# Altium project MB102_Upgrade.PrjPcb
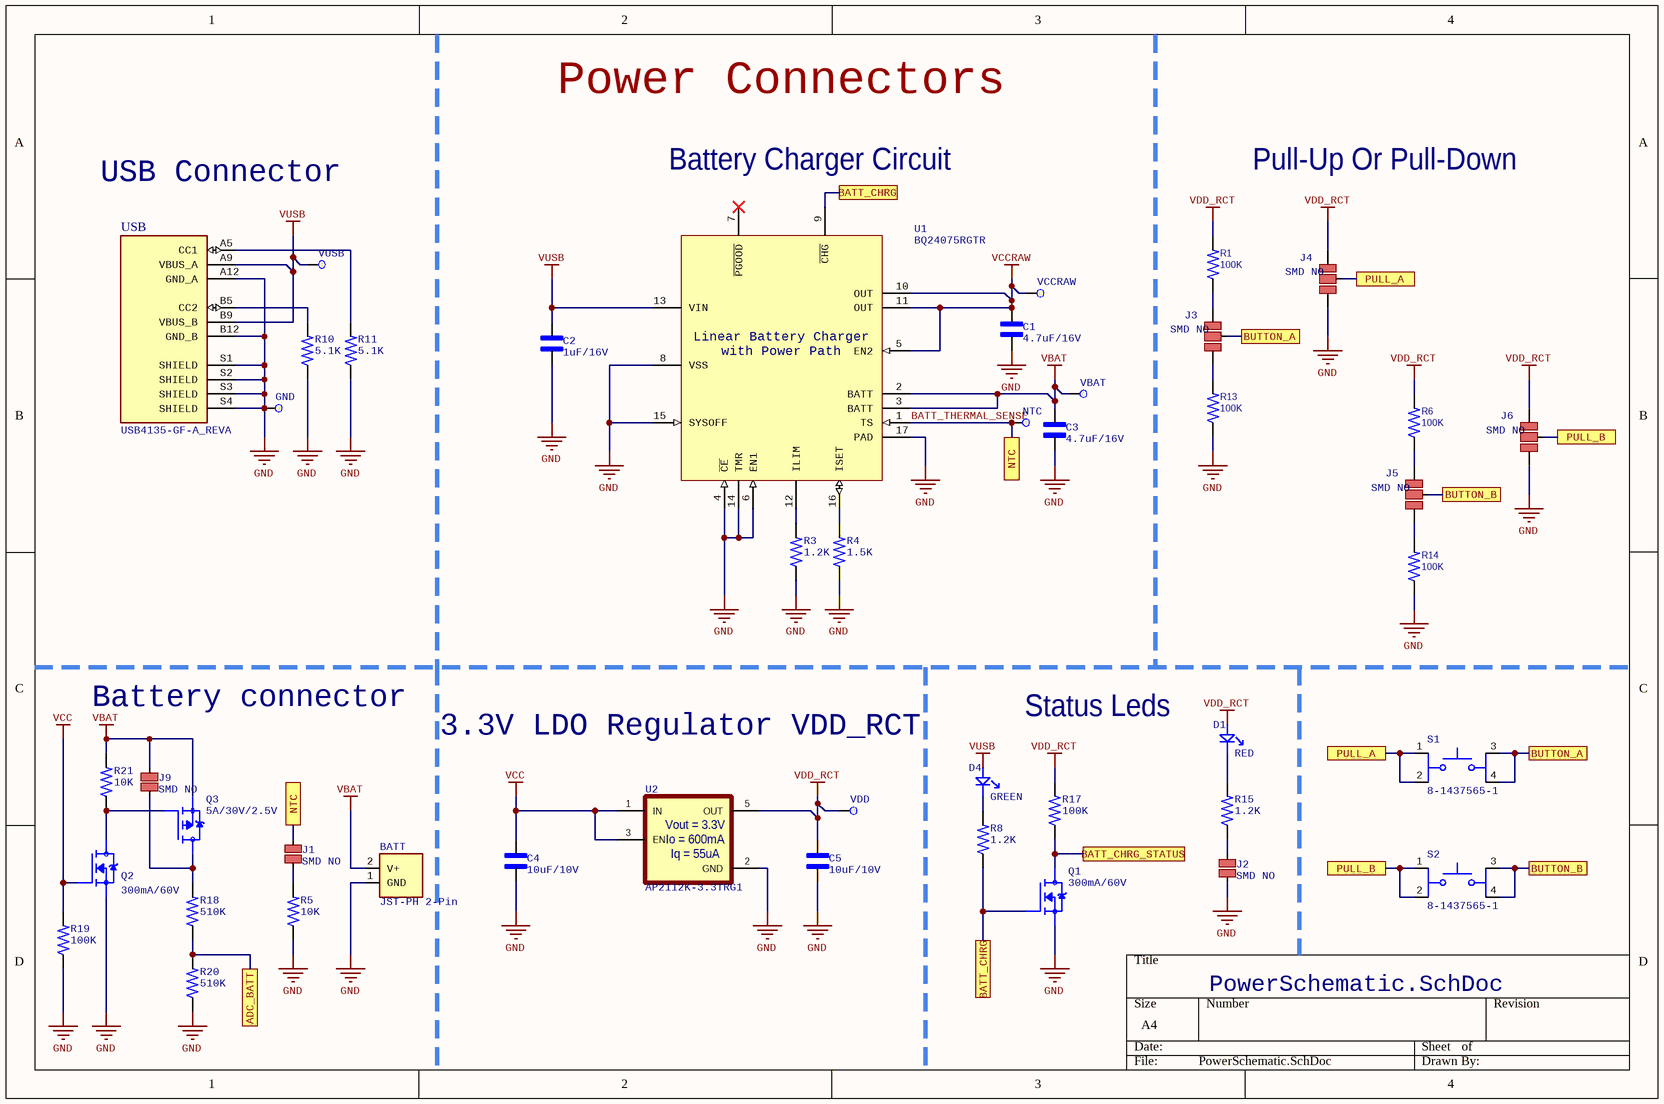
[diagram p0: PowerSchematic.SchDoc]
3 sheets, 81 parts. Net scope: flat (ports and power ports of the same name join across sheets).
Board file: MB102_Upgrade.PcbDoc
Sheets:
  PowerSchematic.SchDoc
  SwitchingRegulators.SchDoc
  Peripherals.SchDoc

## Sheet PowerSchematic.SchDoc
size A4; SheetNumber: 1; SheetTotal: 3

### Parts
BATT  JST-PH 2-Pin  [JST_B2B-PH-K-S(LF)(SN)]
C1  4.7uF/16V  [C0603]
C2  1uF/16V  [C0603]
C3  4.7uF/16V  [C0603]
C4  10uF/10V  [C0603]
C5  10uF/10V  [C0603]
D1  RED  [LED 0603]
D4  GREEN  [LED 0603]
GND  Test point 1.2mm  [TEST_POINT_1.2MM]  (value not drawn)  (no BOM)
J1  SMD NO  [JUMPER_SMD_NO]  (net tie, no BOM)
J2  SMD NO  [JUMPER_SMD_NO]  (net tie, no BOM)
J3  SMD NO  [JUMPER_SMD_NO_2WAY]  (net tie, no BOM)
J4  SMD NO  [JUMPER_SMD_NO_2WAY]  (net tie, no BOM)
J5  SMD NO  [JUMPER_SMD_NO_2WAY]  (net tie, no BOM)
J6  SMD NO  [JUMPER_SMD_NO_2WAY]  (net tie, no BOM)
J9  SMD NO  [JUMPER_SMD_NO]  (net tie, no BOM)
NTC  Test point 1.2mm  [TEST_POINT_1.2MM]  (value not drawn)  (no BOM)
Q1  300mA/60V  [SOT-23-3]
Q2  300mA/60V  [SOT-23-3]
Q3  5A/30V/2.5V  [SOT-23-3]
R1  100K  [R0603]
R3  1.2K  [R0603]
R4  1.5K  [R0603]
R5  10K  [R0603]
R6  100K  [R0603]
R8  1.2K  [R0603]
R10  5.1K  [R0603]
R11  5.1K  [R0603]
R13  100K  [R0603]
R14  100K  [R0603]
R15  1.2K  [R0603]
R17  100K  [R0603]
R18  510K  [R0603]
R19  100K  [R0603]
R20  510K  [R0603]
R21  10K  [R0603]
S1  8-1437565-1  [SW_8-1437565-1]
S2  8-1437565-1  [SW_8-1437565-1]
U1  BQ24075RGTR  [VQFN16]
U2  AP2112K-3.3TRG1  [SOT-25-5]
USB  USB4135-GF-A_REVA  [GCT_USB4135 16-pin]
VBAT  Test point 1.2mm  [TEST_POINT_1.2MM]  (value not drawn)  (no BOM)
VCCRAW  Test point 1.2mm  [TEST_POINT_1.2MM]  (value not drawn)  (no BOM)
VDD  Test point 1.2mm  [TEST_POINT_1.2MM]  (value not drawn)  (no BOM)
VUSB  Test point 1.2mm  [TEST_POINT_1.2MM]  (value not drawn)  (no BOM)

### Ports
ADC_BATT (see Peripherals[4C]), BATT_CHRG (see PowerSchematic[3A]), BATT_CHRG (see PowerSchematic[3D]), BATT_CHRG_STATUS (see Peripherals[4C]), BUTTON_A (see Peripherals[1C], PowerSchematic[3B]), BUTTON_A (see Peripherals[1C], PowerSchematic[4C]), BUTTON_B (see Peripherals[1C], PowerSchematic[4B]), BUTTON_B (see Peripherals[1C], PowerSchematic[4D]), NTC (see PowerSchematic[1D]), NTC (see PowerSchematic[3B]), PULL_A (see PowerSchematic[4B]), PULL_A (see PowerSchematic[4C]), PULL_B (see PowerSchematic[4B]), PULL_B (see PowerSchematic[4D])

### Nets
GND: BATT.1(GND) C1.2 C2.2 C3.2 C4.2 C5.2 GND.1 J2.2 J4.1 J6.1 Q1.2(S) Q2.2(S) R3.1 R4.1 R5.1 R10.1 R11.1 R13.1 R14.1 R19.1 R20.1 U1.4(~{CE}) U1.6(EN1) U1.8(VSS) U1.14(TMR) U1.15(SYSOFF) U1.17(PAD) U2.2(GND) USB.A12(GND_A) USB.B12(GND_B) USB.S1(SHIELD) USB.S2(SHIELD) USB.S3(SHIELD) USB.S4(SHIELD)
VBAT: BATT.2(V+) C3.1 J9.1 Q3.2(S) R21.2 U1.2(BATT) U1.3(BATT) VBAT.1
VCC: C4.1 Q2.1(G) R19.2 U2.1(IN) U2.3(EN)
VCCRAW: C1.1 U1.5(EN2) U1.10(OUT) U1.11(OUT) VCCRAW.1
VDD_RCT: C5.1 D1.1(A) J4.3 J6.3 R1.2 R6.2 R17.2 U2.5(OUT) VDD.1
VUSB: C2.1 D4.1(A) U1.13(VIN) USB.A9(VBUS_A) USB.B9(VBUS_B) VUSB.1
BATT_THERMAL_SENSE: J1.1 NTC.1 U1.1(TS) ; port NTC
NetBUTTONS_1: J3.2 S1.3 S1.4 ; port BUTTON_A
NetBUTTONS_2: J5.2 S2.3 S2.4 ; port BUTTON_B
NetD1_2: D1.2(K) R15.2
NetD4_2: D4.2(K) R8.2
NetJ1_2: J1.2 R5.2
NetJ2_1: J2.1 R15.1
NetJ3_1: J3.1 R13.2
NetJ3_3: J3.3 R1.1
NetJ4_2: J4.2 S1.1 S1.2 ; port PULL_A
NetJ5_1: J5.1 R14.2
NetJ5_3: J5.3 R6.1
NetJ6_2: J6.2 S2.1 S2.2 ; port PULL_B
NetJ9_2: J9.2 Q3.3(D) R18.2
NetP6_1: Q1.3(D) R17.1 ; port BATT_CHRG_STATUS
NetP6_2: R18.1 R20.2 ; port ADC_BATT
NetQ1_1: Q1.1(G) R8.1 U1.9(~{CHG}) ; port BATT_CHRG
NetQ2_3: Q2.3(D) Q3.1(G) R21.1
NetR3_2: R3.2 U1.12(ILIM)
NetR4_2: R4.2 U1.16(ISET)
NetR10_2: R10.2 USB.B5(CC2)
NetR11_2: R11.2 USB.A5(CC1)

Not connected (* = marked no-connect by the designer): U1 7(~{PGOOD})*

### Notes on the sheet
- Power Connectors
- USB Connector
- Battery Charger Circuit
- Pull-Up Or Pull-Down
- Battery connector
- 3.3V LDO Regulator VDD_RCT
- Status Leds
- (in symbol AP2112K-3.3TRG1) Vout = 3.3V; Io = 600mA; Iq = 55uA
- (in symbol BQ24075RGTR) Linear Battery Charger; with Power Path

### Library data of the parts
BATT = JST-PH 2-Pin: JST (JAPAN SOLDERLESS TERMINALS) - B2B-PH-K-S(LF)(SN) - Pin Header, Top Entry, Wire-to-Board, 2 mm, 1 Rows, 2 Contacts, Through Hole, PH Series; Supplier 1: LCSC; Supplier Part Number 1: C131337; Manufacturer: JST; Manufacturer Part Number: B2B-PH-K-S(LF)(SN); RoHS: Yes; Category: Connectors; Stock 1: 3352380; Pricing 1: 20=0.03960, 200=0.03310, 600=0.02840, 2000=0.02160, 10000=0.02100, 20000=0.02070 (USD); Weight: 0.0625lb; Length: 0.2inch; Width: 0.24inch; Height: 0.35inch
C1 C3 = C0603 4.7uF/16V: 0603 4.7 uF 16 V ±10% Tolerance X5R Multilayer Ceramic Capacitor; Manufacturer: Murata; Manufacturer Part Number: GRT188R61C475KE13D; Value: 4.7uF; Voltage Rating: 16V; Supplier 1: Mouser; Supplier Part Number 1: 81-GRT188R61C475KE3D; RoHS: Yes; Category: Ceramic Capacitors; Stock 1: 39950; Pricing 1: 1=0.16, 10=0.066, 50=0.066, 100=0.038, 1000=0.034, 10000=0.029 (USD); Mounting Technology: Surface Mount; Case/Package: 0603; Case Code (Metric): 1608; Case Code (Imperial): 0603; Min Operating Temperature: -55°C; Max Operating Temperature: 85°C; Packaging: Cut Tape; Tolerance: 10%; Series: GRT; Length: 0.063inch; Width: 0.031inch; Thickness: 0.035inch; Ratings: AEC-Q200; RoHS Compliant: Yes
C2 = C0603 1uF/16V X5R: MLCC 1uF 16V X5R 10% SMD 0603 85C Paper T/R; Manufacturer: Yageo; Manufacturer Part Number: CC0603KRX5R7BB105; Dissipation Factor: 7%; Supplier 1: Mouser; Supplier Part Number 1: 603-CC603KRX5R7BB105; RoHS: Yes; Category: Ceramic Capacitors; Stock 1: 726921; Pricing 1: 1=0.17000, 10=0.09100, 50=0.09100, 100=0.04100, 1000=0.03400, 10000=0.02100 (USD); Mount: Surface Mount; Case/Package: 0603; Number of Pins: 2; Case Code (Imperial): 0603; Case Code (Metric): 1608; Min Operating Temperature: -55°C; Max Operating Temperature: 85°C; Capacitance: 1uF; Tolerance: 10%; Dielectric: X5R; Voltage Rating: 16V; Voltage Rating (DC): 16V; Packaging: Tape and Reel; Package Quantity: 4000; Termination: SMD/SMT; Resistor Type: Ceramic; Series: CC; Construction: Flat; Length: 1.6mm; Width: 0.8mm; Height: 0.8mm; Thickness: 0.035inch; Depth: 0.8mm; Radiation Hardening: No; REACH SVHC: Unknown; Lead Free: Lead Free; Halogen Free: Halogen Free; RoHS Compliant: Yes
C4 C5 = C0603 10uF/10V: MLCC 10uF 10V X5R 20% 0603; Manufacturer: Samsung; Manufacturer Part Number: CL10A106MP8NNND; Supplier 1: Mouser; Supplier Part Number 1: 187-CL10A106MP8NNND; RoHS: Yes; Category: Ceramic Capacitors; Stock 1: 58774; Pricing 1: 1=0.20000, 10=0.14000, 50=0.14000, 100=0.06600, 1000=0.03900, 10000=0.03000 (USD); Supplier 2: Mouser; Supplier Part Number 2: 963-LMK107BBJ106MAHT; RoHS Compliant: Yes
D1 = LED 0603 RED: Red 625nm LED Indication - Discrete 2V 0603; Manufacturer: Wurth Electronics; Manufacturer Part Number: 150060RS55040; Luminous Intensity: 90mcd; Lens Style: Flat; Viewing Angle: 140°; Dominant Wavelength: 624nm; Test Current: 20mA; Lens Transparency: Diffused; Lens Size: 0.8mm; Supplier 1: Mouser; Supplier Part Number 1: 710-150060RS55040; RoHS: No; Category: LEDs; Stock 1: 8586; Pricing 1: 1=0.18000, 10=0.16200, 100=0.14700, 500=0.13200, 1000=0.11700, 2000=0.11700 (USD); Mount: Surface Mount; Case/Package: 0603; Color: Red; Forward Voltage: 2V; Packaging: Tape and Reel; Height: 0.5mm; Case Code (Imperial): 0603; Case Code (Metric): 1608; Length: 1.6mm; Width: 0.8mm
D4 = LED 0603 GREEN: Green 575nm LED Indication - Discrete 2V 0603; Manufacturer: Wurth Electronics; Manufacturer Part Number: 150060VS55040; Luminous Intensity: 60mcd; Lens Style: Flat; Viewing Angle: 140°; Dominant Wavelength: 573nm; Test Current: 20mA; Lens Transparency: Diffused; Lens Size: 0.8mm; Supplier 1: Mouser; Supplier Part Number 1: 710-150060VS55040; RoHS: No; Category: LEDs; Stock 1: 24940; Pricing 1: 1=0,18000, 10=0,16200, 50=0,16200, 100=0,14700, 1000=0,11700, 10000=0,11700 (USD); Mount: Surface Mount; Case/Package: 0603; Color: Green; Forward Voltage: 2V; Packaging: Cut Tape; Height: 0.5mm; Case Code (Imperial): 0603; Case Code (Metric): 1608; Length: 1.6mm; Width: 0.8mm
GND NTC VBAT VCCRAW VDD VUSB = Test point: SMD test point
J1 J2 J9 = JUMPER_SMD_NO: Rule: UNIONINDEX=0|RULEKIND=ShortCircuit|NETSCOPE=AnyNet|LAYERKIND=SameLayer|NAME=Schematic Short-Circuit Constraint|ALLOWED=TRUE|UNIT=Imperial
J3-J6 = JUMPER_SMD_NO_2WAY
Q1 Q2 = MOSFET N-CH 2N7002,215: Trans MOSFET N-CH 60V 0.3A 3-Pin TO-236AB T/R; Manufacturer: Nexperia; Supplier 1: Mouser; Supplier Part Number 1: 771-2N7002-T/R; Manufacturer Part Number: 2N7002,215; RoHS: No; Category: MOSFETs; Stock 1: 82531; Pricing 1: 1=0.16000, 10=0.13800, 100=0.05900, 500=0.04800, 1000=0.03300, 3000=0.02500, 9000=0.02200, 24000=0.02000, 45000=0.01500 (USD)
Q3 = MOSFET P-CH 30V/5A SI2347DS-T1-GE3: P-Channel 30 V 42 mOhm 22 nC Surface Mount Power Mosfet - SOT-23-3; Manufacturer: Vishay Semiconductors; Rise Time: 6ns; Rds On Max: 42mR; Input Capacitance: 705pF; Drain to Source Voltage (Vdss): 30V; Continuous Drain Current (ID): 3.8A; Max Power Dissipation: 1.7W; Fall Time: 9ns; Gate to Source Voltage (Vgs): 20V; Drain to Source Resistance: 68mR; Turn-Off Delay Time: 19ns; Number of Elements: 1; Threshold Voltage: -2.5V; Element Configuration: Single; Drain to Source Breakdown Voltage: -30V; Supplier 1: Mouser; Supplier Part Number 1: 78-SI2347DS-T1-GE3; Manufacturer Part Number: Si2347DS-T1-GE3; RoHS: Yes; Category: MOSFETs; Stock 1: 90370; Pricing 1: 1=0.41000, 10=0.27600, 50=0.27600, 100=0.14500, 1000=0.10000, 10000=0.07700 (USD); Mount: Surface Mount; Case/Package: SOT-23-3; Number of Pins: 3; Contact Plating: Tin,Matte; Min Operating Temperature: -55°C; Max Operating Temperature: 150°C; Packaging: Tape and Reel; Package Quantity: 3000; Power Dissipation: 1.7W; Polarity: P-CHANNEL; Series: TrenchFET®; Radiation Hardening: No; REACH SVHC: No SVHC; Lead Free: Lead Free; RoHS Compliant: Yes
R1 R6 R13 R14 = R0603 100K: RES 0603 100K OHM 1% 1/10W; Manufacturer: Yageo; Manufacturer Part Number: RC0603FR-07100KL; Resistance: 100kR; Power Rating: 100mW; Voltage Rating: 50V; Temperature Coefficient: 100ppm/°C; Working Voltage: 75V; RoHS: Yes; Category: Chip SMD Resistors; Stock 1: 4536807; Pricing 1: 1=0.10000, 10=0.02100, 100=0.00900, 1000=0.00400, 5000=0.00300, 10000=0.00200 (USD); Case/Package: 0603; Number of Pins: 2; Case Code (Imperial): 0603; Case Code (Metric): 1608; Min Operating Temperature: -55°C; Max Operating Temperature: 155°C; Tolerance: 1%; Packaging: Tape and Reel; Resistor Type: Thick Film; Termination: SMD/SMT; Voltage Rating (DC): 50V; Length: 1.6mm; Depth: 0.8mm; REACH SVHC: No SVHC; Military Standard: Not; Lead Free: Lead Free; Supplier 1: Mouser; Supplier Part Number 1: 603-RC0603FR-07100KL; Number of Terminations: 2; Height: 0.45mm; Width: 0.8mm
R3 R8 R15 = R0603 1.2K: RES 0603 1.2K OHM 1% 1/10W; Manufacturer: Yageo; Manufacturer Part Number: RC0603FR-071K2L; Power Rating: 100mW; Voltage Rating: 50V; Resistance: 1.2kR; Temperature Coefficient: 100ppm/°C; Supplier 1: Mouser; Supplier Part Number 1: 603-RC0603FR-071K2L; RoHS: Yes; Category: Chip SMD Resistors; Stock 1: 27884; Pricing 1: 1=0.10000, 10=0.02400, 50=0.02400, 100=0.01000, 1000=0.00400, 10000=0.00300 (USD); Case/Package: 0603; Number of Pins: 2; Case Code (Imperial): 0603; Case Code (Metric): 1608; Size Code: 0603; Min Operating Temperature: -55°C; Max Operating Temperature: 155°C; Tolerance: 1%; Voltage Rating (DC): 50V; Packaging: Tape and Reel; Termination: SMD/SMT; Resistor Type: Thick Film; Features: Moisture Resistant; Series: RC; Max Power Dissipation: 100mW; Number of Terminations: 2; Construction: Rectangular; Resistance Tolerance: 1%; Length: 1.6mm; Width: 0.8mm; Height: 0.45mm; Depth: 0.8mm; REACH SVHC: No SVHC; Military Standard: Not; Lead Free: Lead Free; RoHS Compliant: Yes; ComponentLink1URL: http://www.farnell.com/datasheets/443971.pdf?src-supplier=Farnell; ComponentLink1Description: http://www.farnell.com/datasheets/443971.pdf?src-supplier=Farnell; ComponentLink2URL: http://www.farnell.com/datasheets/1868787.pdf?src-supplier=Farnell; ComponentLink2Description: http://www.farnell.com/datasheets/1868787.pdf?src-supplier=Farnell; ComponentLink3URL: http://www.farnell.com/datasheets/2167052.pdf?src-supplier=Farnell; ComponentLink3Description: http://www.farnell.com/datasheets/2167052.pdf?src-supplier=Farnell; ComponentLink4URL: http://www.mouser.com/ds/2/447/RC0603-272842.pdf?src-supplier=Mouser; ComponentLink4Description: http://www.mouser.com/ds/2/447/RC0603-272842.pdf?src-supplier=Mouser; ComponentLink5URL: http://components.arrow.com/part/dataview/0323_00047720?src-supplier=Arrow+Europe; ComponentLink5Description: http://components.arrow.com/part/dataview/0323_00047720?src-supplier=Arrow+Europe; ComponentLink6URL: http://www.farnell.com/datasheets/443971.pdf?src-supplier=Element14; ComponentLink6Description: http://www.farnell.com/datasheets/443971.pdf?src-supplier=Element14; ComponentLink7URL: http://www.farnell.com/datasheets/2167052.pdf?src-supplier=Newark; ComponentLink7Description: http://www.farnell.com/datasheets/2167052.pdf?src-supplier=Newark; ComponentLink8URL: http://www.farnell.com/datasheets/1868787.pdf?src-supplier=Element14; ComponentLink8Description: http://www.farnell.com/datasheets/1868787.pdf?src-supplier=Element14; ComponentLink9URL: http://www.farnell.com/datasheets/2167052.pdf?src-supplier=Element14; ComponentLink9Description: http://www.farnell.com/datasheets/2167052.pdf?src-supplier=Element14; ComponentLink10URL: http://www.yageo.com/documents/recent/PYu-RC0603_51_RoHS_L_7.pdf?src-supplier=Future+Electronics; ComponentLink10Description: http://www.yageo.com/documents/recent/PYu-RC0603_51_RoHS_L_7.pdf?src-supplier=Future+Electronics; ComponentLink11URL: https://www.verical.com/server-webapp/html/getDatasheet?partID=326670&src-supplier=Verical; ComponentLink11Description: https://www.verical.com/server-webapp/html/getDatasheet?partID=326670&src-supplier=Verical; ComponentLink12URL: http://www.farnell.com/datasheets/1868787.pdf?src-supplier=Newark; ComponentLink12Description: http://www.farnell.com/datasheets/1868787.pdf?src-supplier=Newark; ComponentLink13URL: http://www.yageo.com/documents/recent/PYu-RC_Group_51_RoHS_L_9.pdf?src-supplier=Digi-Key; ComponentLink13Description: http://www.yageo.com/documents/recent/PYu-RC_Group_51_RoHS_L_9.pdf?src-supplier=Digi-Key; ComponentLink14URL: http://www.yageo.com/documents/recent/PYu-RC_Group_51_RoHS_L_10.pdf?src-supplier=Digi-Key; ComponentLink14Description: http://www.yageo.com/documents/recent/PYu-RC_Group_51_RoHS_L_10.pdf?src-supplier=Digi-Key
R4 = R0603 1.5K: RES 0603 1.5K OHM 0.5% 1/10W; Manufacturer: Yageo; Manufacturer Part Number: RC0603FR-071K5L; Tolerance: 1%; Resistance: 1.5kR; Temperature Coefficient: 100ppm/°C; Voltage Rating (DC): 50V; Power Rating: 100mW; Supplier 1: Mouser; Supplier Part Number 1: 603-RC0603FR-071K5L; RoHS: Yes; Category: Chip SMD Resistors; Stock 1: 312486; Pricing 1: 1=0.10000, 10=0.01800, 50=0.01800, 100=0.00600, 1000=0.00500, 10000=0.00300 (USD); Case/Package: 0603; Number of Pins: 2; Case Code (Metric): 1608; Case Code (Imperial): 0603; Min Operating Temperature: -55°C; Max Operating Temperature: 155°C; Packaging: Tape and Reel; Resistor Type: Thick Film; Voltage Rating: 50V; Package Quantity: 1; Number of Terminations: 2; Termination: SMD/SMT; Max Power Dissipation: 100mW; Features: Moisture Resistant; Length: 0.063inch; Width: 0.031inch; Height: 0.022inch; Depth: 0.8mm; REACH SVHC: No SVHC; Lead Free: Lead Free; Military Standard: Not
R5 R21 = R0603 10K: SMD Chip Resistor, 10 kOhm, ± 1%, 100 mW, 0603 [1608 Metric], Thick Film, Anti-Sulfur; Manufacturer: Yageo; Manufacturer Part Number: AF0603FR-0710KL; Power Rating: 100mW; Temperature Coefficient: 100ppm/°C; Voltage Rating: 50V; Value: 10kR; Supplier 1: Mouser; Supplier Part Number 1: 603-AF0603FR-0710KL; RoHS: Yes; Category: Chip SMD Resistors; Case/Package: 0603; Case Code (Imperial): 0603; Case Code (Metric): 1608; Min Operating Temperature: -55°C; Max Operating Temperature: 155°C; Tolerance: 1%; Packaging: Tape and Reel; Package Quantity: 1; Termination: SMD/SMT; Number of Terminations: 2; Max Power Dissipation: 100mW; Features: Moisture Resistant,Anti-Sulfur; Length: 0.063inch; Width: 0.031inch; Height: 0.022inch; Lead Free: 5697LeadFree; Supplier 2: Mouser; Supplier Part Number 2: 667-ERJ-3EKF1002V; Stock 3: 5000; Pricing 3: 5000=0.00223, 10000=0.00219, 20000=0.00213 (USD); Series: AF; RoHS Compliant: Yes
R10 R11 = R0603 5.1K: RES 0603 5.1K OHM 1% 1/10W; Manufacturer: Yageo; Manufacturer Part Number: RC0603FR-075K1L; Power Rating: 100mW; Temperature Coefficient: 100ppm/°C; Resistance: 5.1kR; Voltage Rating: 50V; Supplier 1: Mouser; Supplier Part Number 1: 603-RC0603FR-075K1L; RoHS: Yes; Category: Chip SMD Resistors; Stock 1: 557916; Case/Package: 0603; Number of Pins: 2; Case Code (Imperial): 0603; Case Code (Metric): 1608; Min Operating Temperature: -55°C; Max Operating Temperature: 155°C; Tolerance: 1%; Packaging: Tape and Reel; Package Quantity: 1; Termination: SMD/SMT; Resistor Type: Thick Film; Number of Terminations: 2; Max Power Dissipation: 100mW; Voltage Rating (DC): 50V; Features: Moisture Resistant; Length: 0.063inch; Width: 0.031inch; Height: 0.022inch; Depth: 0.8mm; REACH SVHC: No SVHC; Military Standard: Not; Lead Free: Lead Free
R17 R19 = R0603 100K: RES 0603 100K OHM 1% 1/10W; Manufacturer: Yageo; Manufacturer Part Number: RC0603FR-07100KL; Power Rating: 100mW; Voltage Rating: 50V; Resistance: 100kR; Temperature Coefficient: 100ppm/°C; Working Voltage: 75V; Supplier 1: Mouser; Supplier Part Number 1: 603-RC0603FR-07100KL; RoHS: Yes; Category: Chip SMD Resistors; Stock 1: 4536807; Pricing 1: 1=0.10000, 10=0.02100, 100=0.00900, 1000=0.00400, 5000=0.00300, 10000=0.00200 (USD); Case/Package: 0603; Number of Pins: 2; Case Code (Imperial): 0603; Case Code (Metric): 1608; Min Operating Temperature: -55°C; Max Operating Temperature: 155°C; Tolerance: 1%; Voltage Rating (DC): 50V; Packaging: Tape and Reel; Termination: SMD/SMT; Resistor Type: Thick Film; Number of Terminations: 2; Length: 1.6mm; Width: 0.8mm; Height: 0.45mm; Depth: 0.8mm; REACH SVHC: No SVHC; Military Standard: Not; Lead Free: Lead Free
R18 R20 = R0603 510K: RES 0603 510K OHM 1% 1/10W; Manufacturer: TE Connectivity; Manufacturer Part Number: CPF0603B510KE; Tolerance: 0.1%; Temperature Coefficient: 25ppm/°C; Max Power Dissipation: 63mW; Resistance: 510kR; Supplier 1: Mouser; Supplier Part Number 1: 279-CPF0603B510KE; RoHS: Yes; Category: Uncategorized; Case/Package: 0603; Case Code (Imperial): 0603; Case Code (Metric): 1608; Min Operating Temperature: -55°C; Max Operating Temperature: 155°C; Packaging: Cut Tape; Number of Terminations: 2; Series: CPF, Neohm; RoHS Compliant: Yes; Stock 1: 16357; Pricing 1: 1=0.49, 10=0.329, 50=0.329, 100=0.187, 1000=0.1, 10000=0.092 (USD)
S1 S2 = 8-1437565-1: Switch Tactile OFF (ON) SPST Round Button Gull Wing 0.05A 24VDC 1.57N SMD T/R; Manufacturer: TE Connectivity Alcoswitch; Actuator Material: Brass; Mechanical Life: 500000Cycles; Illumination Type: Non-Illuminated; Contact Current Rating: 20mA; Switch Function: Off-Mom; Switch Travel: 0.25mm; Actuator Type: Standard; Max Voltage Rating (DC): 15V; Contact Resistance: 100mR; Number of Positions: 2NUMBER; Actuator Length: 0.4mm; Supplier 1: Mouser; Supplier Part Number 1: 506-8-1437565-1; Manufacturer Part Number: 8-1437565-1; RoHS: Yes; Category: Pushbutton Switches; Stock 1: 20150; Pricing 1: 1=0.72, 10=0.72, 50=0.72, 100=0.697, 1000=0.567, 10000=0.371 (USD); Mount: Surface Mount; Case/Package: SMD/SMT; Contact Material: Copper Alloy; Contact Plating: Silver; Min Operating Temperature: -35°C; Max Operating Temperature: 85°C; Packaging: Tape and Reel; Throw Configuration: SPST; Operating Force: 1.57N; Termination: Gull Wing; Series: FSMCT; Package Quantity: 4000; Type: Switch; Orientation: Straight; Electrical Life: 500000Cycles; Height: 1.7mm; Radiation Hardening: No; RoHS Compliant: Yes; Lead Free: 5697LeadFree; ELV: 5681ELVCompliant; ComponentLink1URL: https://datasheet.ciiva.com/8082/eng-cs-1308111-1-switches-core-program-catalog-0308-8082416.pdf?src-supplier=Avnet; ComponentLink1Description: https://datasheet.ciiva.com/8082/eng-cs-1308111-1-switches-core-program-catalog-0308-8082416.pdf?src-supplier=Avnet
U1 = BQ24075RGTR: IC LI-ION CHARGE MGMT 16-QFN; Manufacturer: Texas Instruments; Output Voltage: 4.2V; Output Current: 1.5A; Min Supply Voltage: 4.35V; Max Supply Voltage: 6.4V; Min Input Voltage: 4.3V; Number of Cells: 1; Interface: USB; Fault Protection: Over Voltage,Over Temperature,Short Circuit,Reverse Current; Battery Chemistry: LITHIUM-ION; Supplier 1: Mouser; Supplier Part Number 1: 595-BQ24075RGTR; Manufacturer Part Number: BQ24075RGTR; RoHS: Yes; Category: Battery Management; Stock 1: 21933; Pricing 1: 1=2.52000, 10=2.27000, 50=2.14000, 100=1.82000, 1000=1.24000, 10000=1.24000 (USD); Case/Package: VQFN; Number of Pins: 16; Weight: 0.000808oz; Contact Plating: Gold; Min Operating Temperature: -40°C; Max Operating Temperature: 125°C; Packaging: Tape and Reel; Package Quantity: 3000; Series: -; Max Charge Current: 1.5A; Battery Pack Voltage: 4.2V; Radiation Hardening: No; Lead Free: Lead Free; RoHS Compliant: Yes; ComponentLink1URL: https://datasheet.ciiva.com/15114/getdatasheetpartid-471953-15114762.pdf?src-supplier=Verical; ComponentLink1Description: https://datasheet.ciiva.com/15114/getdatasheetpartid-471953-15114762.pdf?src-supplier=Verical; ComponentLink2URL: https://datasheet.ciiva.com/3214/bq24079-3214043.pdf?src-supplier=Avnet; ComponentLink2Description: https://datasheet.ciiva.com/3214/bq24079-3214043.pdf?src-supplier=Avnet; ComponentLink3URL: https://datasheet.ciiva.com/1934/bq24072-1934514.pdf?src-supplier=Digi-Key; ComponentLink3Description: https://datasheet.ciiva.com/1934/bq24072-1934514.pdf?src-supplier=Digi-Key; Supplier 2: Digi-Key; Supplier Part Number 2: 296-38874-1-ND; Supplier 3: Digi-Key; Supplier Part Number 3: 296-38874-2-ND; Supplier 4: Arrow Electronics; Supplier Part Number 4: BQ24075RGTR
U2 = AP2112K-3.3TRG1: IC REG LINEAR 3.3V 600MA SOT25; Manufacturer: Diodes; Min Input Voltage: 2.5V; Number of Outputs: 1; Dropout Voltage: 250mV; Max Input Voltage: 6V; Quiescent Current: 55uA; Polarity: Positive; Accuracy: 1.5%; Output Type: Fixed; Supplier 1: Mouser; Supplier Part Number 1: 621-AP2112K-3.3TRG1; Manufacturer Part Number: AP2112K-3.3TRG1; RoHS: Yes; Category: Voltage Regulators - Linear; Stock 1: 4864; Pricing 1: 1=0.47000, 10=0.31700, 50=0.31700, 100=0.15000, 1000=0.11600, 10000=0.08900 (USD); Mount: Surface Mount; Case/Package: SOT-23-5; Number of Pins: 5; Min Operating Temperature: -40°C; Max Operating Temperature: 85°C; Package Quantity: 1; Packaging: Tape and Reel; Output Voltage: 3.3V; Output Current: 600mA; Number of Regulators: 1; Max Output Current: 600mA; Length: 3.1mm; Width: 1.7mm; Height: 1.3mm; Lead Free: Lead Free; RoHS Compliant: Yes; ComponentLink1URL: https://datasheet.ciiva.com/29569/ap2112-29569917.pdf?src-supplier=Digi-Key; ComponentLink1Description: https://datasheet.ciiva.com/29569/ap2112-29569917.pdf?src-supplier=Digi-Key; ComponentLink2URL: https://datasheet.ciiva.com/29569/ap2112-29569918.pdf?src-supplier=Digi-Key; ComponentLink2Description: https://datasheet.ciiva.com/29569/ap2112-29569918.pdf?src-supplier=Digi-Key; ComponentLink3URL: https://datasheet.ciiva.com/29569/ap2112-29569919.pdf?src-supplier=Digi-Key; ComponentLink3Description: https://datasheet.ciiva.com/29569/ap2112-29569919.pdf?src-supplier=Digi-Key; ComponentLink4URL: https://datasheet.ciiva.com/30016/ap2112-30016792.pdf?src-supplier=Avnet; ComponentLink4Description: https://datasheet.ciiva.com/30016/ap2112-30016792.pdf?src-supplier=Avnet
USB = USB4135-GF-A_REVA: Usb C Rec Gf Ra 6P SMT & SMT She; Manufacturer 1: Global Connector Technology; Supplier 1: Mouser; Supplier Part Number 1: 640-USB4135-GF-A; Manufacturer Part Number 1: USB4135-GF-A; RoHS: No; Category: Connectors; Stock 1: 1196; Pricing 1: 1=0.67300, 50=0.59700, 100=0.56000, 250=0.52200, 500=0.46600, 1000=0.43300, 1500=0.40000, 3000=0.33600 (USD)

## Sheet SwitchingRegulators.SchDoc
size Letter; SheetNumber: 2; SheetTotal: 3
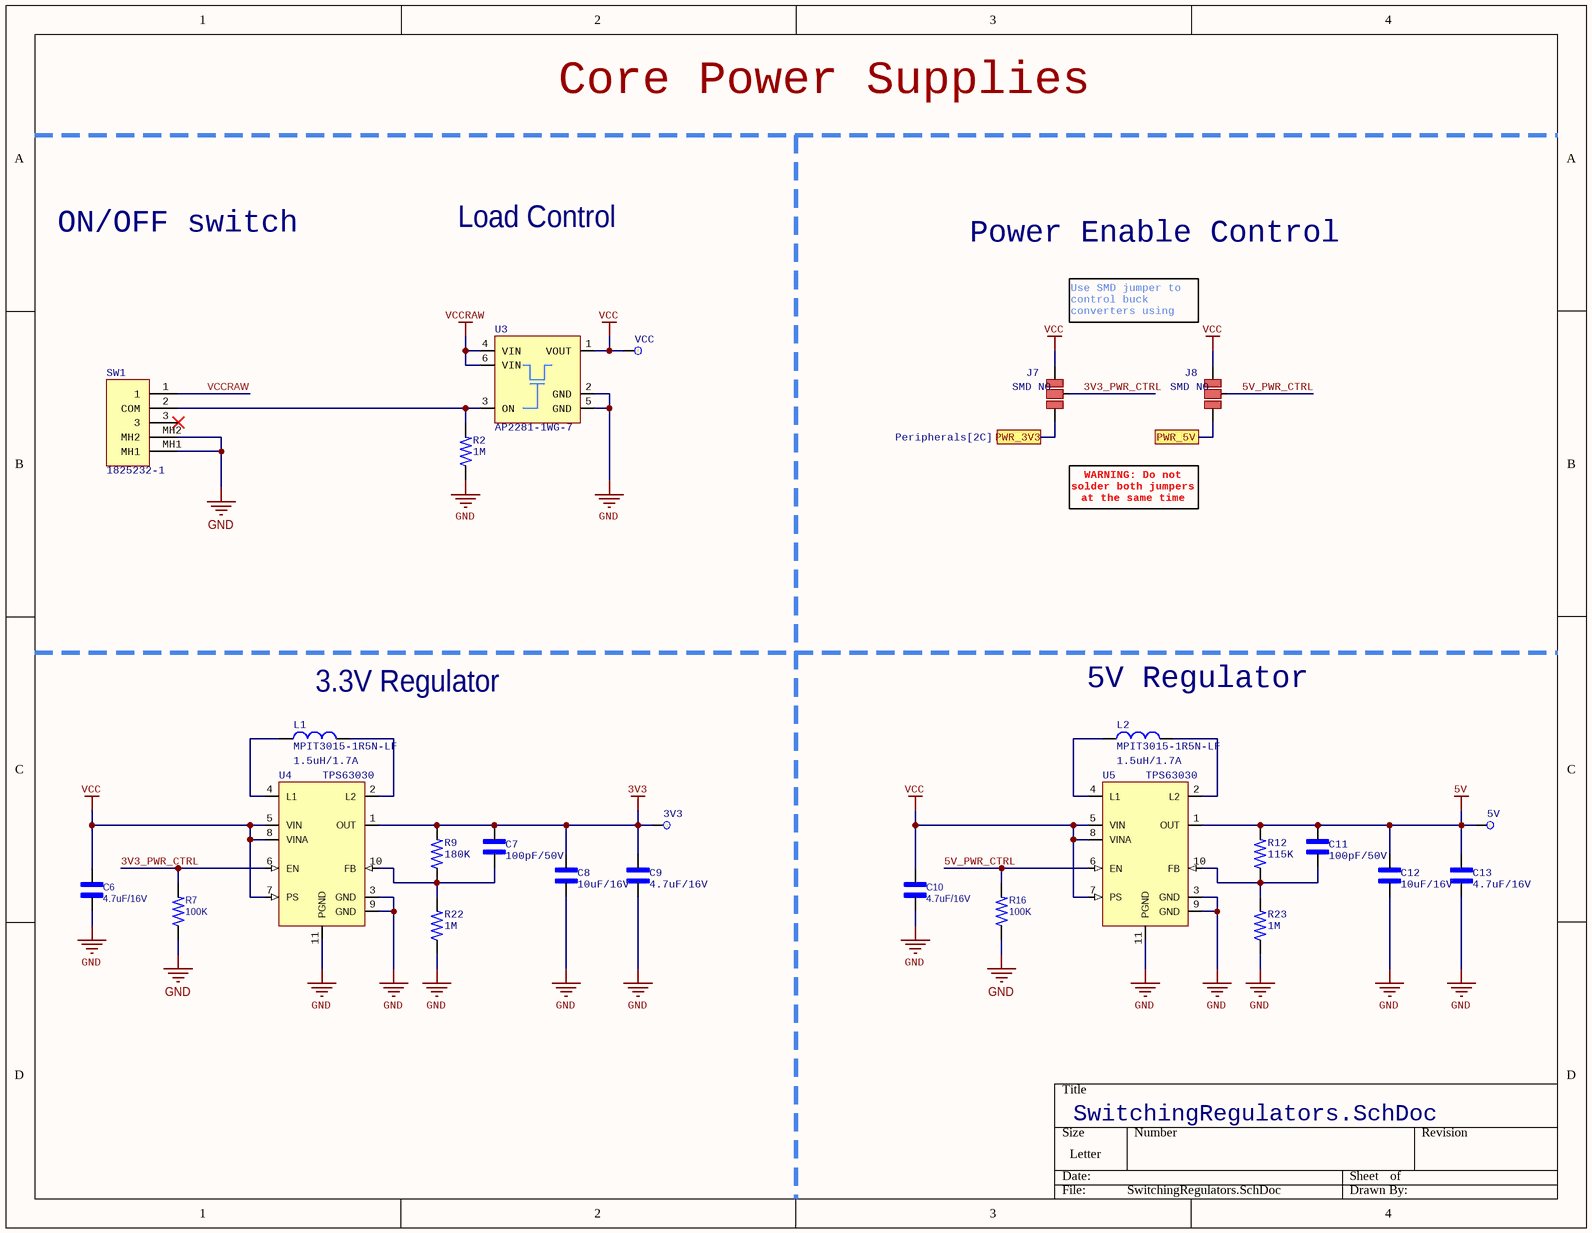
[diagram p1: SwitchingRegulators.SchDoc]

### Parts
3V3  Test point 1.2mm  [TEST_POINT_1.2MM]  (value not drawn)  (no BOM)
5V  Test point 1.2mm  [TEST_POINT_1.2MM]  (value not drawn)  (no BOM)
C6  4.7uF/16V  [C0603]
C7  100pF/50V  [C0603]
C8  10uF/16V  [C0603]
C9  4.7uF/16V  [C0603]
C10  4.7uF/16V  [C0603]
C11  100pF/50V  [C0603]
C12  10uF/16V  [C0603]
C13  4.7uF/16V  [C0603]
J7  SMD NO  [JUMPER_SMD_NO_2WAY]  (net tie, no BOM)
J8  SMD NO  [JUMPER_SMD_NO_2WAY]  (net tie, no BOM)
L1  1.5uH/1.7A  [L3030_SHIELD_H15]
L2  1.5uH/1.7A  [L3030_SHIELD_H15]
R2  1M  [R0603]
R7  100K  [R0603]
R9  180K  [R0603]
R12  115K  [R0603]
R16  100K  [R0603]
R22  1M  [R0603]
R23  1M  [R0603]
SW1  1825232-1  [1825232-1]
U3  AP2281-1WG-7  [SOT-26-6]
U4  TPS63030  [WSON-N10]
U5  TPS63030  [WSON-N10]
VCC  Test point 1.2mm  [TEST_POINT_1.2MM]  (value not drawn)  (no BOM)

### Ports
PWR_3V3 (see Peripherals[2C]), PWR_5V (see Peripherals[2C])

### Nets
3V3: 3V3.1 C7.1 C8.1 C9.1 R9.2 U4.1(OUT)
5V: 5V.1 C11.1 C12.1 C13.1 R12.2 U5.1(OUT)
GND: C6.2 C8.2 C9.2 C10.2 C12.2 C13.2 R2.1 R7.1 R16.1 R22.1 R23.1 SW1.MH1 SW1.MH2 U3.2(GND) U3.5(GND) U4.3(GND) U4.9(GND) U4.11(PGND) U5.3(GND) U5.9(GND) U5.11(PGND)
VCC: C6.1 C10.1 J7.3 J8.3 U3.1(VOUT) U4.5(VIN) U4.7(PS) U4.8(VINA) U5.5(VIN) U5.7(PS) U5.8(VINA) VCC.1
VCCRAW: SW1.1 U3.4(VIN) U3.6(VIN)
3V3_PWR_CTRL: J7.2 R7.2 U4.6(EN)
5V_PWR_CTRL: J8.2 R16.2 U5.6(EN)
NetC7_2: C7.2 R9.1 R22.2 U4.10(FB)
NetC11_2: C11.2 R12.1 R23.2 U5.10(FB)
NetJ7_1: J7.1 ; port PWR_3V3
NetJ8_1: J8.1 ; port PWR_5V
NetL1_1: L1.1 U4.4(L1)
NetL1_2: L1.2 U4.2(L2)
NetL2_1: L2.1 U5.4(L1)
NetL2_2: L2.2 U5.2(L2)
NetR2_2: R2.2 SW1.2(COM) U3.3(ON)

Not connected (* = marked no-connect by the designer): SW1 3*

### Notes on the sheet
- Core Power Supplies
- ON/OFF switch
- Load Control
- Power Enable Control
- Use SMD jumper to control buck converters using MCU
- WARNING: Do not solder both jumpers at the same time
- (near L1) 3.3V Regulator
- (near L2) 5V Regulator

### Library data of the parts
3V3 5V VCC = Test point: SMD test point
C6 C9 C10 C13 = C0603 4.7uF/16V: MLCC 0603 4.7uF 16V 10% X5R; Manufacturer 1: Murata; Manufacturer Part Number 1: GRT188R61C475KE13D; Supplier 1: Mouser; Supplier Part Number 1: 81-GRT188R61C475KE3D; RoHS: Yes; Category: Ceramic Capacitors; Stock 1: 39950; Pricing 1: 1=0.16, 10=0.066, 50=0.066, 100=0.038, 1000=0.034, 10000=0.029 (USD); RoHS Compliant: Yes; Mounting Technology: Surface Mount; Case/Package: 0603; Case Code (Metric): 1608; Case Code (Imperial): 0603; Min Operating Temperature: -55°C; Max Operating Temperature: 85°C; Packaging: Cut Tape; Value: 4.7uF; Voltage Rating: 16V; Tolerance: 10%; Series: GRT; Length: 0.063inch; Width: 0.031inch; Thickness: 0.035inch; Ratings: AEC-Q200
C7 C11 = C0603 100pF/50V: AVX - 06035A101JAT2A - SMD Multilayer Ceramic Capacitor, 100 pF, 5%, C0G / NP0, 50 V, 0603 [1608 Metric] RoHS Compliant: Yes; Manufacturer: Kyocera AVX; Capacitance: 100pF; Voltage Rating (DC): 50V; Temperature Coefficient: 30ppm/°C; Insulation Resistance: 100GR; Supplier 1: Mouser; Supplier Part Number 1: 581-06035A101J; Manufacturer Part Number: 06035A101JAT2A; RoHS: Yes; Category: Ceramic Capacitors; Stock 1: 438925; Pricing 1: 1=0.10000, 10=0.04100, 50=0.04100, 100=0.03300, 1000=0.01900, 10000=0.01200 (USD); Mount: Surface Mount,PCB; Case/Package: 0603; Number of Pins: 2; Case Code (Metric): 1608; Case Code (Imperial): 0603; Min Operating Temperature: -55°C; Max Operating Temperature: 125°C; Tolerance: 5%; Dielectric: C0G; Packaging: Tape and Reel; Voltage: 50V; Voltage Rating: 50V; Package Quantity: 1; Termination: SMD/SMT; Length: 1.6mm; Width: 0.032inch; Height: 0.9mm; Depth: 0.81mm; Thickness: 0.035inch; Radiation Hardening: No; REACH SVHC: No SVHC; Lead Free: Lead Free; RoHS Compliant: Yes; Supplier 2: Mouser; Supplier Part Number 2: 77-VJ0603A101JXAAC
C8 C12 = C0603 10uF/16V: MLCC 0603 10uF 16V 20% X5R; Manufacturer 1: Murata; Manufacturer Part Number 1: GRM188R61C106MAALD; Material: Ceramic; Supplier 1: Mouser; Supplier Part Number 1: 81-GRM188R61C106MALD; RoHS: Yes; Category: Ceramic Capacitors; Stock 1: 9439; Pricing 1: 1=0.38000, 10=0.27100, 50=0.27100, 100=0.16200, 1000=0.10300, 10000=0.08800 (USD); Mount: Surface Mount; Case/Package: 0603; Case Code (Metric): 1608; Case Code (Imperial): 0603; Min Operating Temperature: -55°C; Max Operating Temperature: 85°C; Packaging: Cut Tape; Capacitance: 10uF; Voltage Rating: 16V; Tolerance: 20%; Voltage Rating (DC): 16V; Length: 0.063inch; Width: 0.031inch; Height: 0.8mm; Thickness: 0.037inch; Lead Free: Lead Free; Supplier 2: Mouser; Supplier Part Number 2: 81-ZRB18AR61C106ME1L; Supplier 3: Mouser; Supplier Part Number 3: 810-C1608X5R1C106M
J7 J8 = JUMPER_SMD_NO_2WAY
L1 L2 = MPIT3015-1R5N-LF: Inductor Power Shielded Wirewound 1.5uH 20% 152MHz Metal 2.3A 0.05Ohm DCR 1212 T/R; Manufacturer 1: microgate; Supplier 1: LCSC; Supplier Part Number 1: C486478; RoHS: Yes; Category: Fixed Inductors; Manufacturer Part Number 1: MPIT3015-1R5N-LF
R2 = R0603 1M: RES SMD 1M OHM 1% 1/10W 0603; Manufacturer: Yageo; Manufacturer Part Number: RC0603FR-071ML; Voltage Rating: 75V; Voltage Rating (DC): 50V; Resistance: 1MR; Power Rating: 100mW; Temperature Coefficient: 100ppm/°C; Application(s): HIGH RELIABILITY; Supplier 1: Mouser; Supplier Part Number 1: 603-RC0603FR-071ML; RoHS: Yes; Category: Chip SMD Resistors; Stock 1: 1321822; Pricing 1: 1=0.10000, 10=0.01800, 50=0.01800, 100=0.00700, 1000=0.00400, 10000=0.00200 (USD); Case/Package: 0603; Number of Pins: 2; Case Code (Imperial): 0603; Case Code (Metric): 1608; Weight: 0.000847oz; Min Operating Temperature: -55°C; Max Operating Temperature: 155°C; Tolerance: 1%; Packaging: Cut Tape; Package Quantity: 5000; Termination: SMD/SMT; Resistor Type: Thick Film; Type: General Purpose; Series: RC; Technology: THICK FILM; Length: 1.6mm; Width: 0.8mm; Height: 0.45mm; Depth: 0.8mm; RoHS Compliant: Yes; REACH SVHC: No SVHC; Military Standard: Not; Lead Free: Lead Free
R7 R16 = R0603 100K: as R1 on sheet PowerSchematic; RoHS: Yes; Category: Chip SMD Resistors; Stock 1: 4536807; Pricing 1: 1=0.10000, 10=0.02100, 100=0.00900, 1000=0.00400, 5000=0.00300, 10000=0.00200 (USD); Case/Package: 0603; Number of Pins: 2; Case Code (Imperial): 0603; Case Code (Metric): 1608; Min Operating Temperature: -55°C; Max Operating Temperature: 155°C; Tolerance: 1%; Packaging: Tape and Reel; Resistor Type: Thick Film; Termination: SMD/SMT; Voltage Rating (DC): 50V; Length: 1.6mm; Depth: 0.8mm; REACH SVHC: No SVHC; Military Standard: Not; Lead Free: Lead Free; Supplier 1: Mouser; Supplier Part Number 1: 603-RC0603FR-07100KL; Number of Terminations: 2; Height: 0.45mm; Width: 0.8mm
R9 = R0603 220K: RES 0603 220K OHM 1% 1/10W; Manufacturer 1: Yageo; Manufacturer Part Number 1: RC0603FR-07220KL; Power Rating: 100mW; Voltage Rating: 50V; Temperature Coefficient: 100ppm/°C; Resistance: 220kR; Supplier 1: Mouser; Supplier Part Number 1: 603-RC0603FR-07220KL; RoHS: Yes; Category: Chip SMD Resistors; Stock 1: 155701; Pricing 1: 1=0.10000, 10=0.02400, 50=0.02400, 100=0.01000, 1000=0.00400, 10000=0.00300 (USD); Case/Package: 0603; Case Code (Metric): 1608; Case Code (Imperial): 0603; Min Operating Temperature: -55°C; Max Operating Temperature: 155°C; Packaging: Tape and Reel; Tolerance: 1%; Number of Terminations: 2; Termination: SMD/SMT; Max Power Dissipation: 100mW; Series: RC; Length: 0.063inch; Width: 0.031inch; Height: 0.022inch; RoHS Compliant: Yes; Features: Moisture Resistant; Number of Pins: 2; Size Code: 0603; Voltage Rating (DC): 50V; Package Quantity: 1; Resistor Type: Thick Film; Technology: THICK FILM; Resistance Tolerance: 1%; Depth: 0.8mm; REACH SVHC: No SVHC; Lead Free: Lead Free
R12 = R0603 220K: RES 0603 115K OHM 1% 1/10W; Manufacturer 1: Yageo; Manufacturer Part Number 1: RC0603FR-07220KL; Power Rating: 100mW; Voltage Rating: 50V; Temperature Coefficient: 100ppm/°C; Resistance: 220kR; Supplier 1: Mouser; Supplier Part Number 1: 603-RC0603FR-07220KL; RoHS: Yes; Category: Chip SMD Resistors; Stock 1: 155701; Pricing 1: 1=0.10000, 10=0.02400, 50=0.02400, 100=0.01000, 1000=0.00400, 10000=0.00300 (USD); Case/Package: 0603; Case Code (Metric): 1608; Case Code (Imperial): 0603; Min Operating Temperature: -55°C; Max Operating Temperature: 155°C; Packaging: Tape and Reel; Tolerance: 1%; Number of Terminations: 2; Termination: SMD/SMT; Max Power Dissipation: 100mW; Series: RC; Length: 0.063inch; Width: 0.031inch; Height: 0.022inch; RoHS Compliant: Yes; Features: Moisture Resistant; Number of Pins: 2; Size Code: 0603; Voltage Rating (DC): 50V; Package Quantity: 1; Resistor Type: Thick Film; Technology: THICK FILM; Resistance Tolerance: 1%; Depth: 0.8mm; REACH SVHC: No SVHC; Lead Free: Lead Free
R22 = R0603 1M: RES 0603 1M OHM 1% 1/10W; Manufacturer 1: Yageo; Manufacturer Part Number 1: RC0603FR-071ML; Voltage Rating: 75V; Voltage Rating (DC): 50V; Resistance: 1MR; Power Rating: 100mW; Temperature Coefficient: 100ppm/°C; Application(s): HIGH RELIABILITY; Supplier 1: Mouser; Supplier Part Number 1: 603-RC0603FR-071ML; RoHS: Yes; Category: Chip SMD Resistors; Stock 1: 1321822; Pricing 1: 1=0.10000, 10=0.01800, 50=0.01800, 100=0.00700, 1000=0.00400, 10000=0.00200 (USD); RoHS Compliant: Yes; Case/Package: 0603; Number of Pins: 2; Case Code (Imperial): 0603; Case Code (Metric): 1608; Weight: 0.000847oz; Min Operating Temperature: -55°C; Max Operating Temperature: 155°C; Tolerance: 1%; Packaging: Cut Tape; Package Quantity: 5000; Termination: SMD/SMT; Resistor Type: Thick Film; Type: General Purpose; Series: RC; Technology: THICK FILM; Length: 1.6mm; Width: 0.8mm; Height: 0.45mm; Depth: 0.8mm; REACH SVHC: No SVHC; Military Standard: Not; Lead Free: Lead Free
R23 = R0603 2M: RES 0603 2M OHM 1% 1/10W; Manufacturer 1: Vishay; Manufacturer Part Number 1: CRCW06032M00FKEAC; Supplier 1: Mouser; Supplier Part Number 1: 71-CRCW06032M00FKEAC; RoHS: Yes; Category: Chip SMD Resistors; Stock 1: 40195; Pricing 1: 1=0.10000, 10=0.04300, 50=0.04300, 100=0.01800, 1000=0.00900, 10000=0.00500 (USD); RoHS Compliant: Yes; Supplier 2: Digi-Key; Supplier Part Number 2: 541-5333-1-ND
SW1 = 1825232-1: Slide Switch, SPDT, On-on, Latched, 0.2A, 30VDC, Solder Terminal, Panel Mount; Manufacturer: TE Connectivity AMP; Mechanical Life: 10000Cycles; Actuator Material: Nylon; Voltage Rating (DC): 30V; Current Rating: 200mA; Operating Force: 200gf; Switch Travel: 2mm; Number of Positions: 2; PCB Mount Retention: With; Actuator Type: Standard; Actuator Length: 0.118inch; Tail Length: 0.094inch; Manufacturer Part Number: 1825232-1; RoHS: Yes; Category: Slide Switches; Stock 1: 12457; Pricing 1: 1=0.4, 10=0.382, 50=0.361, 100=0.321, 1000=0.247, 10000=0.24 (USD); Mounting Technology: Through Hole; Contact Material: Copper Alloy; Contact Plating: Silver; Min Operating Temperature: -20°C; Max Operating Temperature: 70°C; Throw Configuration: SPDT; Package Quantity: 19200; Packaging: Tray; Max Voltage Rating (DC): 30V; Termination: PC Pin; Electrical Life: 10000Cycles; Orientation: Right Angle; Contact Current Rating: 200mA; Switch Function: On-On; Type: Switch; Length: 0.3563inch; Width: 4.3mm; ELV: Compliant; Flammability Rating: UL94 HB; RoHS Compliant: Yes; ComponentLink1URL: https://datasheet.ciiva.com/15085/eng-cd-1825232-b2-15085854.pdf?src-supplier=Digi-Key; ComponentLink1Description: https://datasheet.ciiva.com/15085/eng-cd-1825232-b2-15085854.pdf?src-supplier=Digi-Key; Supplier 1: Mouser; Supplier Part Number 1: 655-1825232-1; Supplier 2: Digi-Key; Supplier Part Number 2: A107673-ND
U3 = AP2281-1WG-7: Load Switch P-Channel 2A SOT-26-6; Manufacturer: Diodes; Number of Outputs: 1; Max Power Dissipation: 720mW; Output Current: 0A; Max Supply Voltage: 6V; Min Supply Voltage: 1.5V; On-State Resistance: 210mR; Interface: On/Off; Output Configuration: High Side; On-state Resistance-Max: 100MR; Supplier 1: Mouser; Supplier Part Number 1: 621-AP2281-1WG-7; Manufacturer Part Number: AP2281-1WG-7; RoHS: Yes; Stock 1: 4712; Pricing 1: 1=0.66000, 10=0.57900, 50=0.57900, 100=0.44400, 250=0.41200, 500=0.35100, 1000=0.28100, 3000=0.25400, 6000=0.23900, 9000=0.23700, 10000=0.23700 (USD); Category: Hot Swap Controllers; Mount: Surface Mount; Case/Package: SOT-26; Number of Pins: 6; Min Operating Temperature: -40°C; Max Operating Temperature: 85°C; Packaging: Tape and Reel; Package Quantity: 3000; Current Rating: 2A; Max Output Current: 2A; Power Dissipation: 720mW; Series: -; Rated Current-Max: 2A; Radiation Hardening: No; REACH SVHC: No SVHC; Lead Free: Lead Free; RoHS Compliant: Yes; Supplier 2: LCSC; Supplier Part Number 2: C127279
U4 U5 = TPS63030DSKR: Buck-Boost Switching Regulator IC Positive Adjustable 1.2V 1 Output 900mA (Switch) 10-WFDFN Exposed Pad; Manufacturer 1: Texas Instruments; Quiescent Current: 25uA; Output Voltage: 5.5V; Output Current: 800mA; Min Input Voltage: 1.8V; Number of Outputs: 1; Switching Frequency: 2.4MHz; Synchronous Rectifier: Yes; Efficiency: 96%; Supply Current: 50uA; Supplier 1: Mouser; Supplier Part Number 1: 595-TPS63030DSKR; RoHS: Yes; Manufacturer Part Number 1: TPS63030DSKR; Category: Voltage Regulators - Switching; Stock: 10596; Pricing: 1=1.91, 10=1.64, 50=1.64, 100=1.41, 1000=1.01, 10000=0.886 (USD); Mounting Technology: Surface Mount; Case/Package: SON; Pins: 10; Min Operating Temperature: -40°C; Max Operating Temperature: 85°C; Packaging: Tape and Reel; Package Quantity: 3000; Max Output current: 800mA; Max Supply Voltage: 5.5V; Operating Supply Voltage: 5.5V; Output Type: Adjustable; Series: -; Min Output Voltage: 1.2V; Max Output Voltage: 5.5V; Topology: Buck-Boost; Min Supply Voltage: 1.8V; Output Configuration: Positive; Radiation Hardening: No; Lead Free: Lead Free; RoHS Compliant: Yes; Reach SVHC Compliant: No; Supplier 2: LCSC; Supplier Part Number 2: C12462

## Sheet Peripherals.SchDoc
size Letter; SheetNumber: 3; SheetTotal: 3
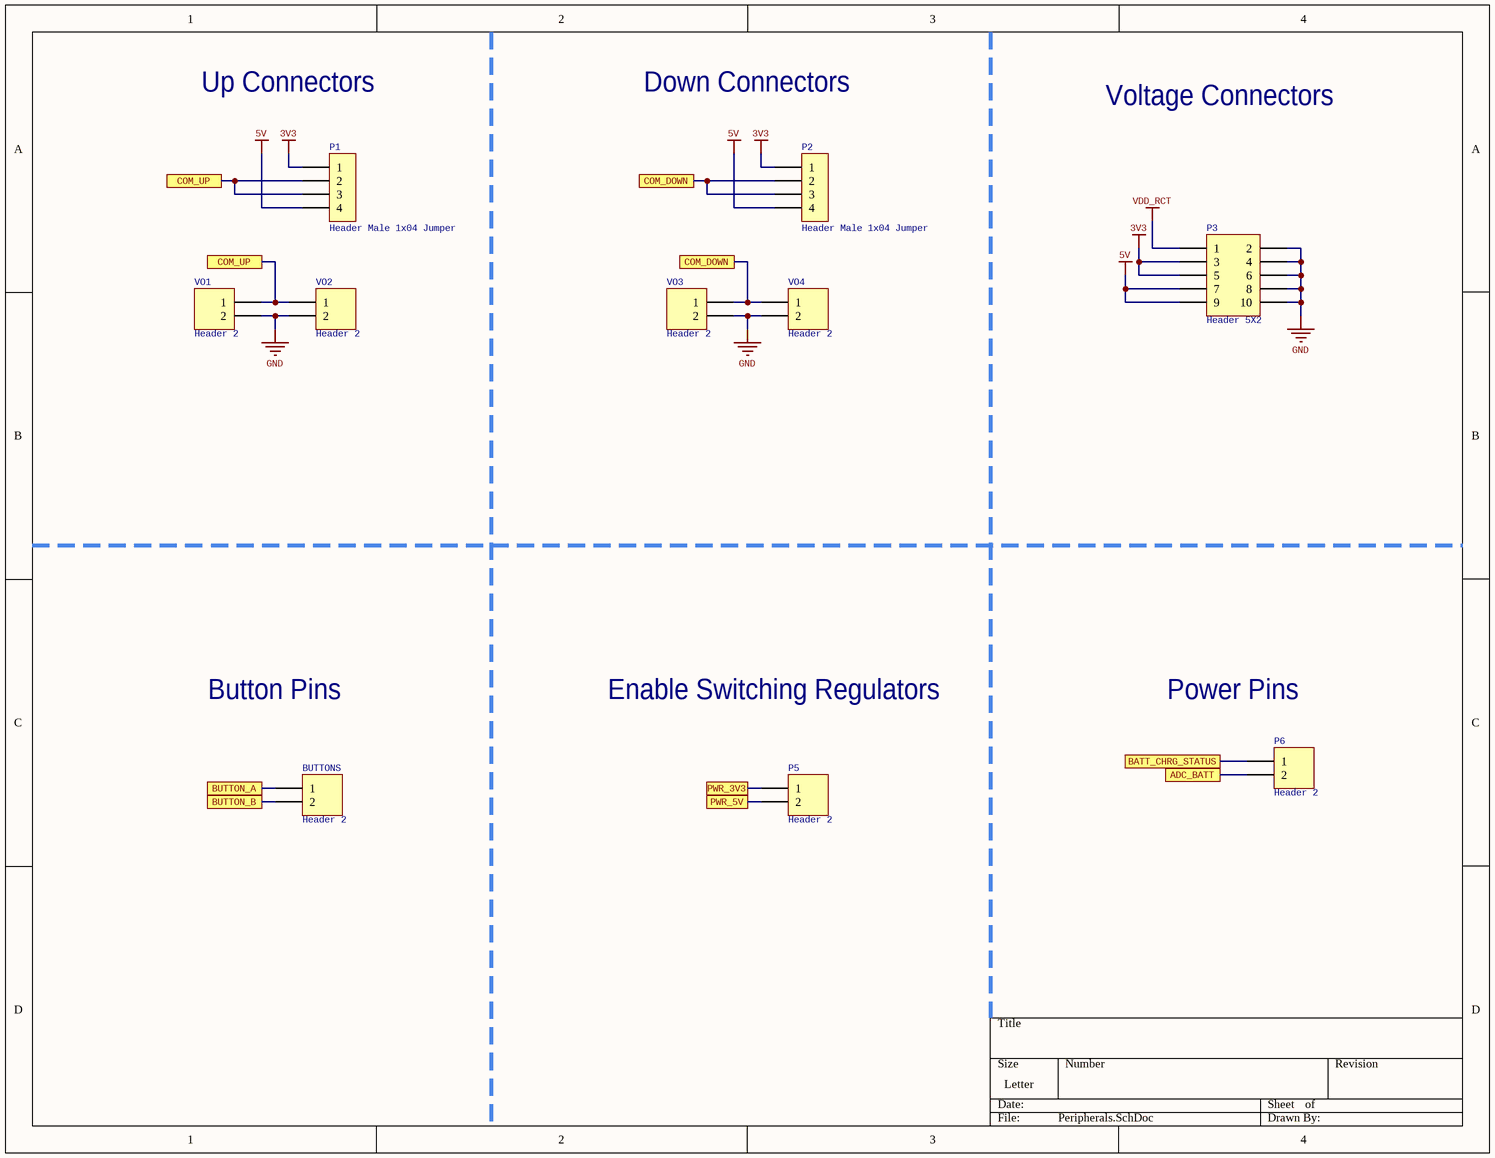
[diagram p2: Peripherals.SchDoc]

### Parts
BUTTONS  Header 2  [HDR1X2]  (no BOM)
P1  Header Male 1x04 Jumper  [Header 1x04 Jumper]  (no BOM)
P2  Header Male 1x04 Jumper  [Header 1x04 Jumper]  (no BOM)
P3  Header 5X2  [HDR2X5]  (no BOM)
P5  Header 2  [HDR1X2]  (no BOM)
P6  Header 2  [HDR1X2]  (no BOM)
VO1  Header 2  [HDR1X2]  (no BOM)
VO2  Header 2  [HDR1X2]  (no BOM)
VO3  Header 2  [HDR1X2]  (no BOM)
VO4  Header 2  [HDR1X2]  (no BOM)

### Ports
ADC_BATT (see PowerSchematic[1D]), BATT_CHRG_STATUS (see PowerSchematic[3D]), BUTTON_A (see PowerSchematic[3B], PowerSchematic[4C]), BUTTON_B (see PowerSchematic[4B], PowerSchematic[4D]), COM_DOWN (see Peripherals[2A]), COM_UP (see Peripherals[1A]), PWR_3V3 (see SwitchingRegulators[3B]), PWR_5V (see SwitchingRegulators[3B])

### Nets
3V3: P1.1 P2.1 P3.3 P3.5
5V: P1.4 P2.4 P3.7 P3.9
GND: P3.2 P3.4 P3.6 P3.8 P3.10 VO1.2 VO2.2 VO3.2 VO4.2
VDD_RCT: P3.1
NetBUTTONS_1: BUTTONS.1 ; port BUTTON_A
NetBUTTONS_2: BUTTONS.2 ; port BUTTON_B
NetJ7_1: P5.1 ; port PWR_3V3
NetJ8_1: P5.2 ; port PWR_5V
NetP1_2: P1.2 P1.3 VO1.1 VO2.1 ; port COM_UP
NetP2_2: P2.2 P2.3 VO3.1 VO4.1 ; port COM_DOWN
NetP6_1: P6.1 ; port BATT_CHRG_STATUS
NetP6_2: P6.2 ; port ADC_BATT

### Notes on the sheet
- Up Connectors
- Down Connectors
- Voltage Connectors
- Button Pins
- Enable Switching Regulators
- Power Pins

### Library data of the parts
BUTTONS P5 P6 VO1-VO4 = Header 2: Header, 2-Pin; LatestRevisionDate: 17-Jul-2002; LatestRevisionNote: Re-released for DXP Platform.; Publisher: Altium Limited
P1 P2 = Header Male Jumper 1x04
P3 = Header 5X2: Header, 5-Pin, Dual row; LatestRevisionDate: 17-Jul-2002; LatestRevisionNote: Re-released for DXP Platform.; Publisher: Altium Limited

## Nets that join several sheets
3V3: SwitchingRegulators (6 pins), Peripherals (P1.1 P2.1 P3.3 P3.5)
5V: SwitchingRegulators (6 pins), Peripherals (P1.4 P2.4 P3.7 P3.9)
GND: PowerSchematic (34 pins), SwitchingRegulators (21 pins), Peripherals (9 pins)
VCC: PowerSchematic (5 pins), SwitchingRegulators (12 pins)
VCCRAW: PowerSchematic (5 pins), SwitchingRegulators (SW1.1 U3.4 U3.6)
VDD_RCT: PowerSchematic (9 pins), Peripherals (P3.1)
NetBUTTONS_1: PowerSchematic (J3.2 S1.3 S1.4), Peripherals (BUTTONS.1)
NetBUTTONS_2: PowerSchematic (J5.2 S2.3 S2.4), Peripherals (BUTTONS.2)
NetJ7_1: SwitchingRegulators (J7.1), Peripherals (P5.1)
NetJ8_1: SwitchingRegulators (J8.1), Peripherals (P5.2)
NetP6_1: PowerSchematic (Q1.3 R17.1), Peripherals (P6.1)
NetP6_2: PowerSchematic (R18.1 R20.2), Peripherals (P6.2)